# Altium schematic sheet signal2.SchDoc
size A4; SheetNumber: 2; SheetTotal: 6
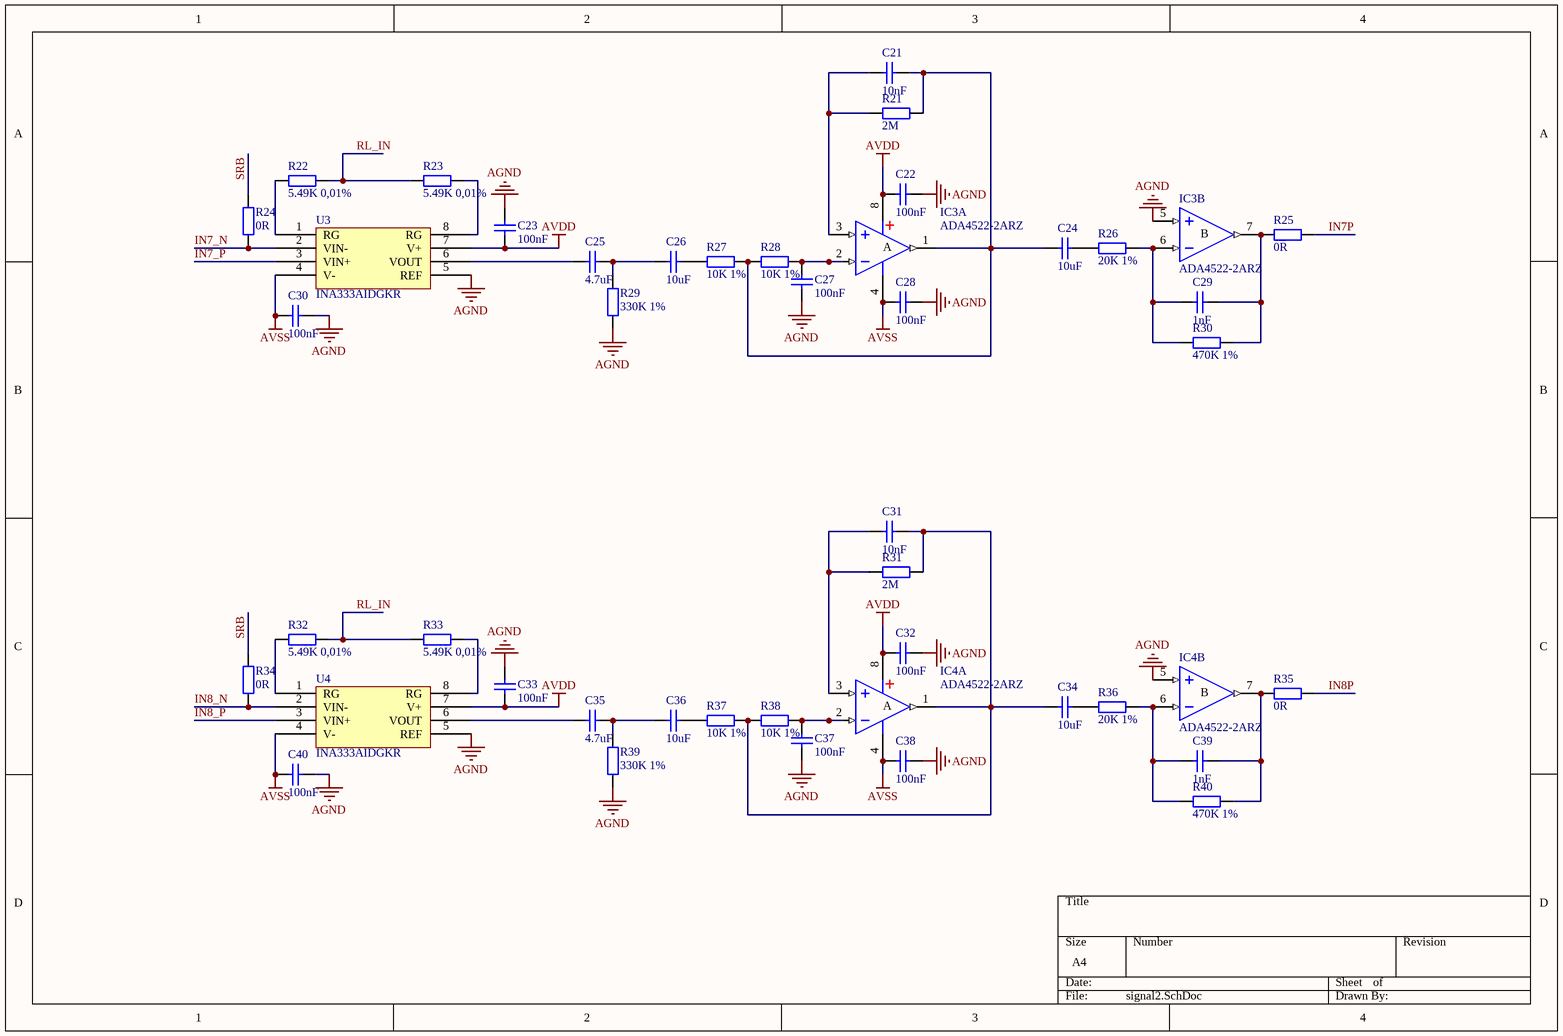
[diagram p0: signal2.SchDoc]

## Parts
C21  10nF  [C0603_L]
C22  100nF  [C0603_L]
C23  100nF  [C0603_L]
C24  10uF  [C0603_L]
C25  4.7uF  [C0603_L]
C26  10uF  [C0603_L]
C27  100nF  [C0603_L]
C28  100nF  [C0603_L]
C29  1nF  [C0603_L]
C30  100nF  [C0603_L]
C31  10nF  [C0603_L]
C32  100nF  [C0603_L]
C33  100nF  [C0603_L]
C34  10uF  [C0603_L]
C35  4.7uF  [C0603_L]
C36  10uF  [C0603_L]
C37  100nF  [C0603_L]
C38  100nF  [C0603_L]
C39  1nF  [C0603_L]
C40  100nF  [C0603_L]
IC3  ADA4522-2ARZ  [SOIC-8]  (parts A,B of 2)
IC4  ADA4522-2ARZ  [SOIC-8]  (parts A,B of 2)
R21  2M  [R0603_L]
R22  5.49K 0,01%  [R0603_M]
R23  5.49K 0,01%  [R0603_M]
R24  0R  [R0603_L]
R25  0R  [R0603_L]
R26  20K 1%  [R0603_L]
R27  10K 1%  [R0603_L]
R28  10K 1%  [R0603_L]
R29  330K 1%  [R0603_L]
R30  470K 1%  [R0603_L]
R31  2M  [R0603_L]
R32  5.49K 0,01%  [R0603_M]
R33  5.49K 0,01%  [R0603_M]
R34  0R  [R0603_L]
R35  0R  [R0603_L]
R36  20K 1%  [R0603_L]
R37  10K 1%  [R0603_L]
R38  10K 1%  [R0603_L]
R39  330K 1%  [R0603_L]
R40  470K 1%  [R0603_L]
U3  INA333AIDGKR  [MSOP8_N]
U4  INA333AIDGKR  [MSOP8_N]

## Nets
AGND: C22.2 C23.1 C27.1 C28.2 C30.1 C32.2 C33.1 C37.1 C38.2 C40.1 IC3.5(IN+) IC4.5(IN+) R29.1 R39.1 U3.5(REF) U4.5(REF)
AVDD: C22.1 C23.2 C32.1 C33.2 IC3.8(V+) IC4.8(V+) U3.7(V+) U4.7(V+)
AVSS: C28.1 C30.2 C38.1 C40.2 IC3.4(V-) IC4.4(V-) U3.4(V-) U4.4(V-)
IN7_N: R24.2 U3.2(VIN-)
IN7_P: U3.3(VIN+)
IN7P: R25.1
IN8_N: R34.2 U4.2(VIN-)
IN8_P: U4.3(VIN+)
IN8P: R35.1
RL_IN: R22.2 R23.1 R32.2 R33.1
SRB: R24.1 R34.1
NetC21_1: C21.1 IC3.3(IN+) R21.2
NetC21_2: C21.2 C24.1 IC3.1(OUT) R21.1 R27.1 R28.2
NetC24_2: C24.2 R26.2
NetC25_1: C25.1 U3.6(VOUT)
NetC25_2: C25.2 C26.1 R29.2
NetC26_2: C26.2 R27.2
NetC27_2: C27.2 IC3.2(IN-) R28.1
NetC29_1: C29.1 IC3.6(IN-) R26.1 R30.2
NetC29_2: C29.2 IC3.7(OUT) R25.2 R30.1
NetC31_1: C31.1 IC4.3(IN+) R31.2
NetC31_2: C31.2 C34.1 IC4.1(OUT) R31.1 R37.1 R38.2
NetC34_2: C34.2 R36.2
NetC35_1: C35.1 U4.6(VOUT)
NetC35_2: C35.2 C36.1 R39.2
NetC36_2: C36.2 R37.2
NetC37_2: C37.2 IC4.2(IN-) R38.1
NetC39_1: C39.1 IC4.6(IN-) R36.1 R40.2
NetC39_2: C39.2 IC4.7(OUT) R35.2 R40.1
NetR22_1: R22.1 U3.1(RG)
NetR23_2: R23.2 U3.8(RG)
NetR32_1: R32.1 U4.1(RG)
NetR33_2: R33.2 U4.8(RG)

## Notes on the sheet
- (in symbol ADA4522-2ARZ, part A) A
- (in symbol ADA4522-2ARZ, part B) B

## Library data of the parts
C21-C40 = C: 贴片电容/MLCC电容; BOM名称: 无极性贴片电容; 联系下单店铺卖家 免费帮你查找封装: 联系下单店铺卖家 免费技术指导
IC3 IC4 = ADA4522-2ARZ: 双通道55V、EMI增强型、零漂移、超低噪声、RRO运算放大器; BOM名称: 双路运放; 封装库来自淘宝卖家：黄晶宝石: 其他店铺购入均为赃物，无售后更新权益，请立即申请退款，退款后现金奖励200~1000元; jlc_id: C403697
R21-R40 = R: 贴片电阻; 联系下单店铺卖家 免费帮你查找封装: 联系下单店铺卖家 免费技术指导; BOM名称: 贴片电阻
U3 U4 = INA333AIDGKR: INA333 低功耗、零漂移、精密仪表放大器; jlc_id: C19450